# EasyEDA Pro project ProPrj_Practice 4 layer_2025-09-09.epro, schematic Schematic1, sheets 4 to 5 of 5

## Sheets
4 P5: Create Date: 2025-09-04; Page Name: P5; Update Date: 2025-09-03
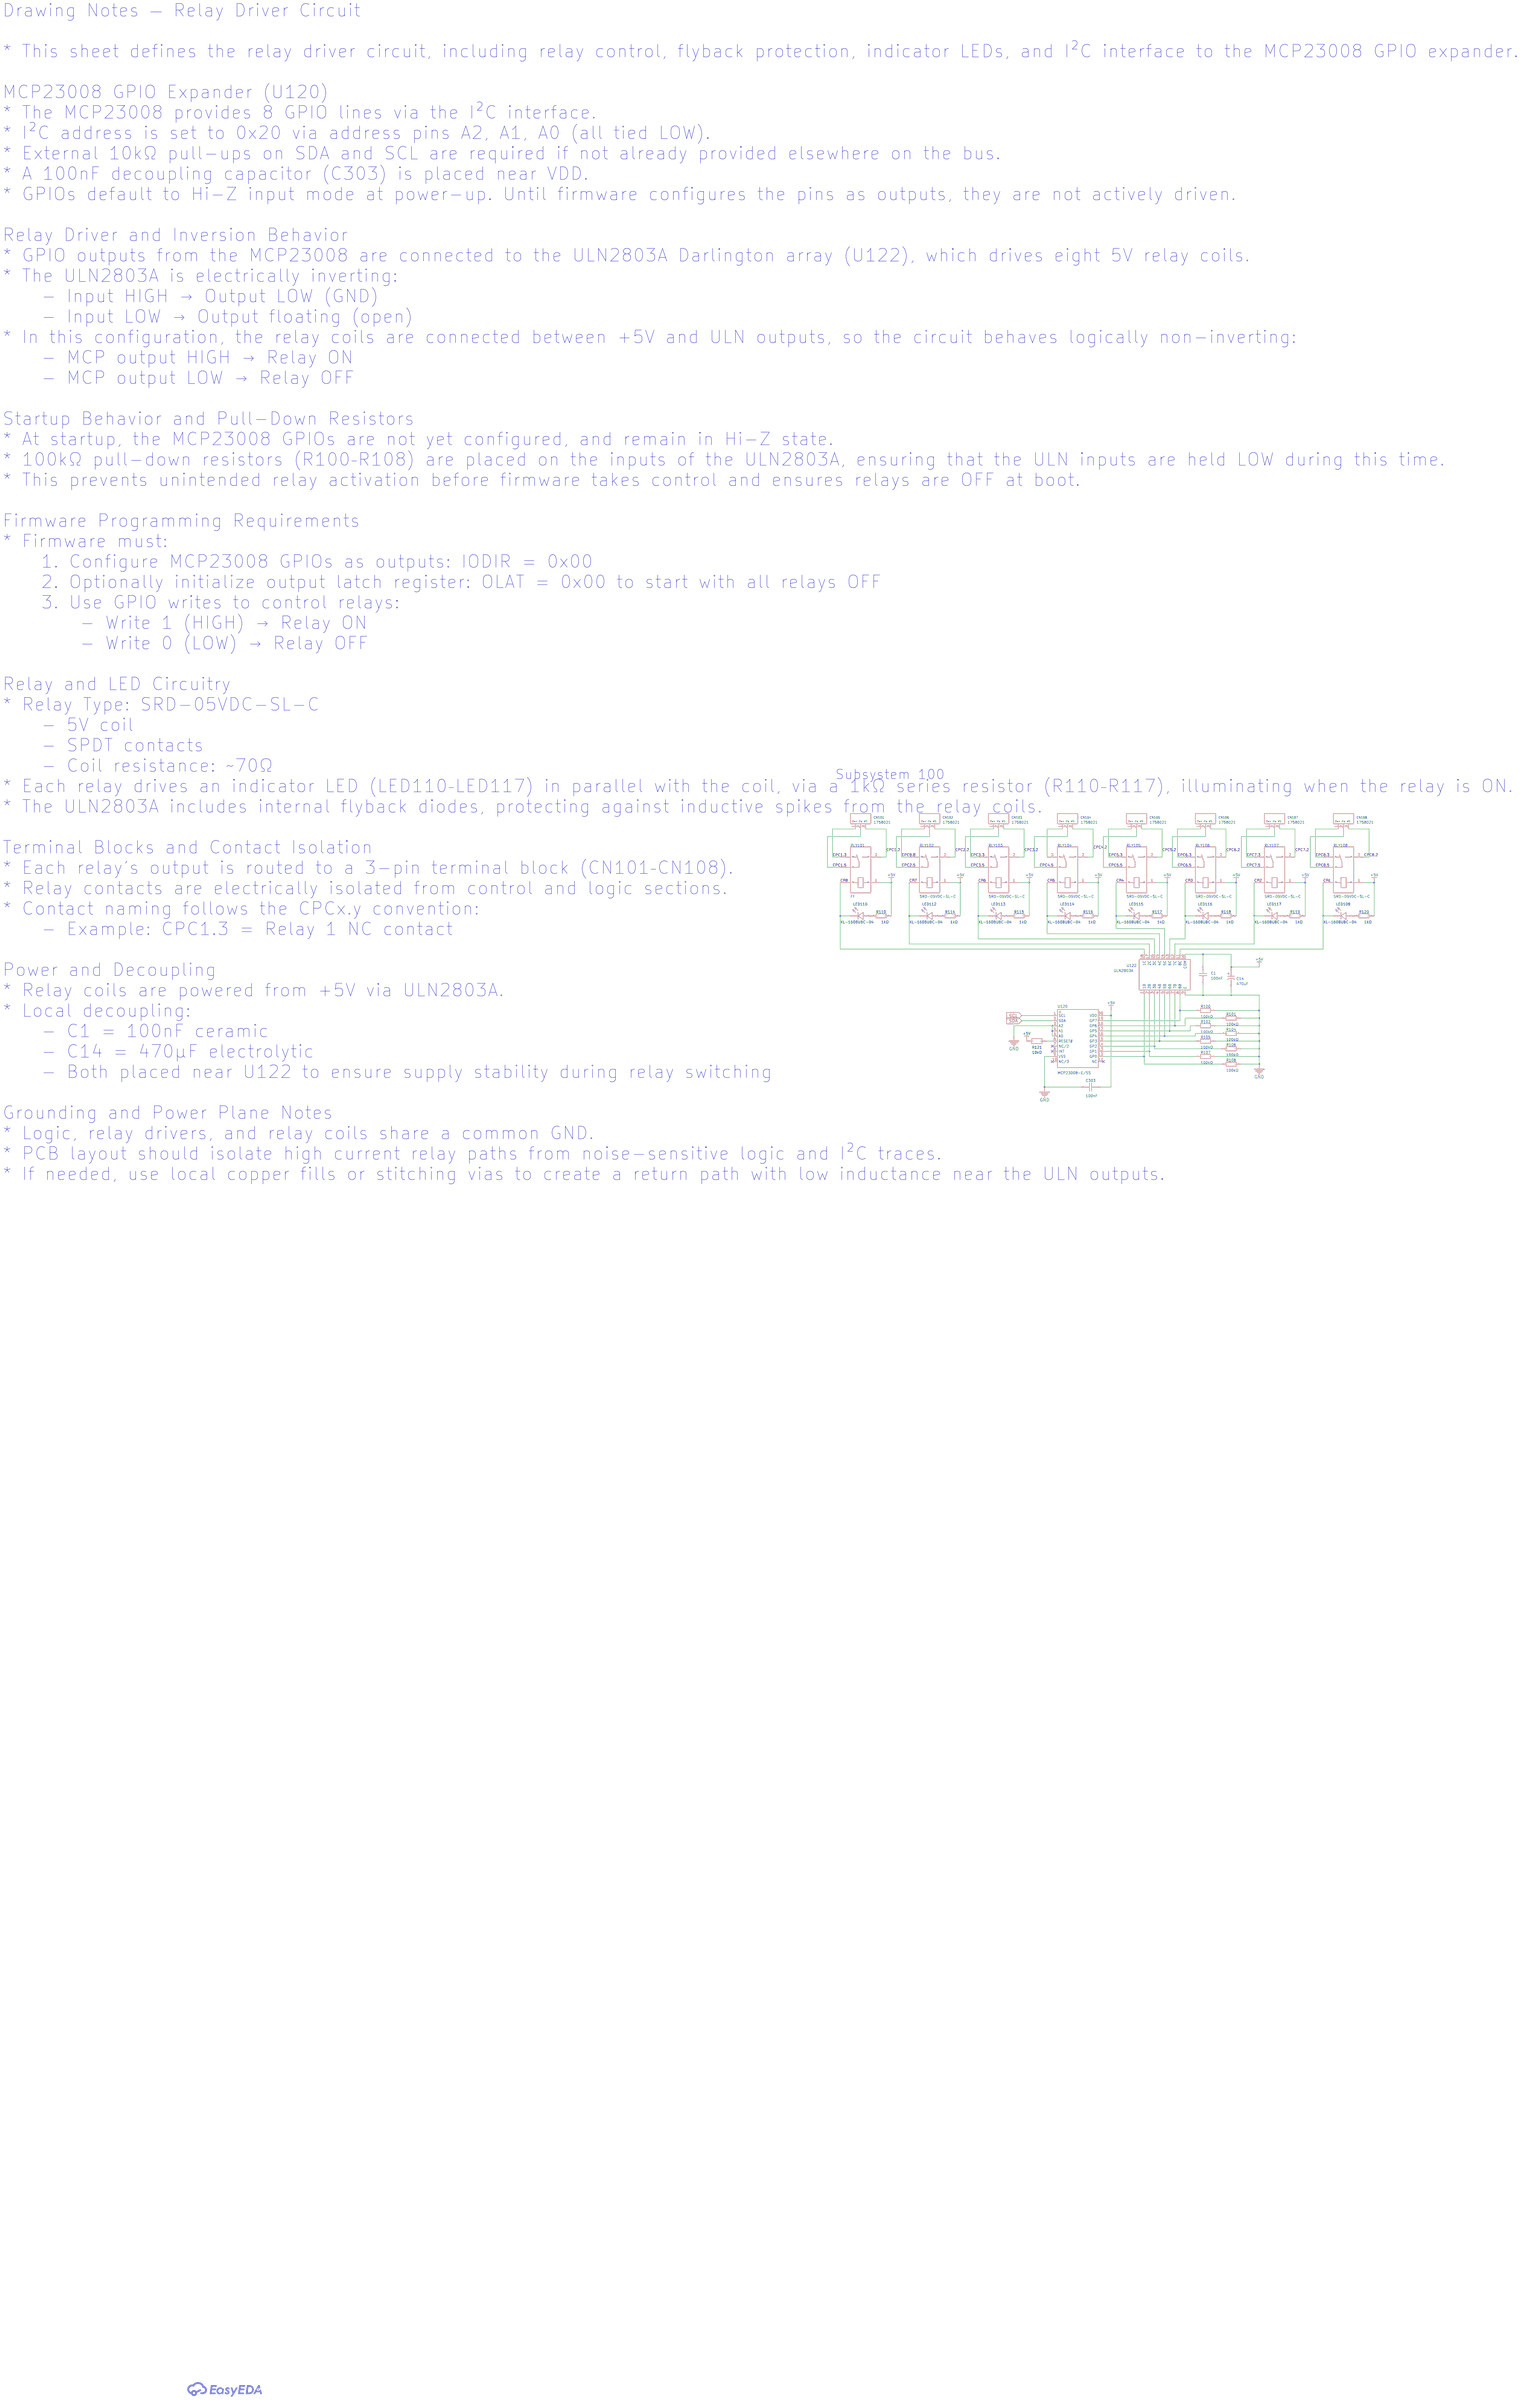
[diagram p13: P5]
5 P6: Create Date: 2025-09-03; Page Name: P6; Update Date: 2025-09-05
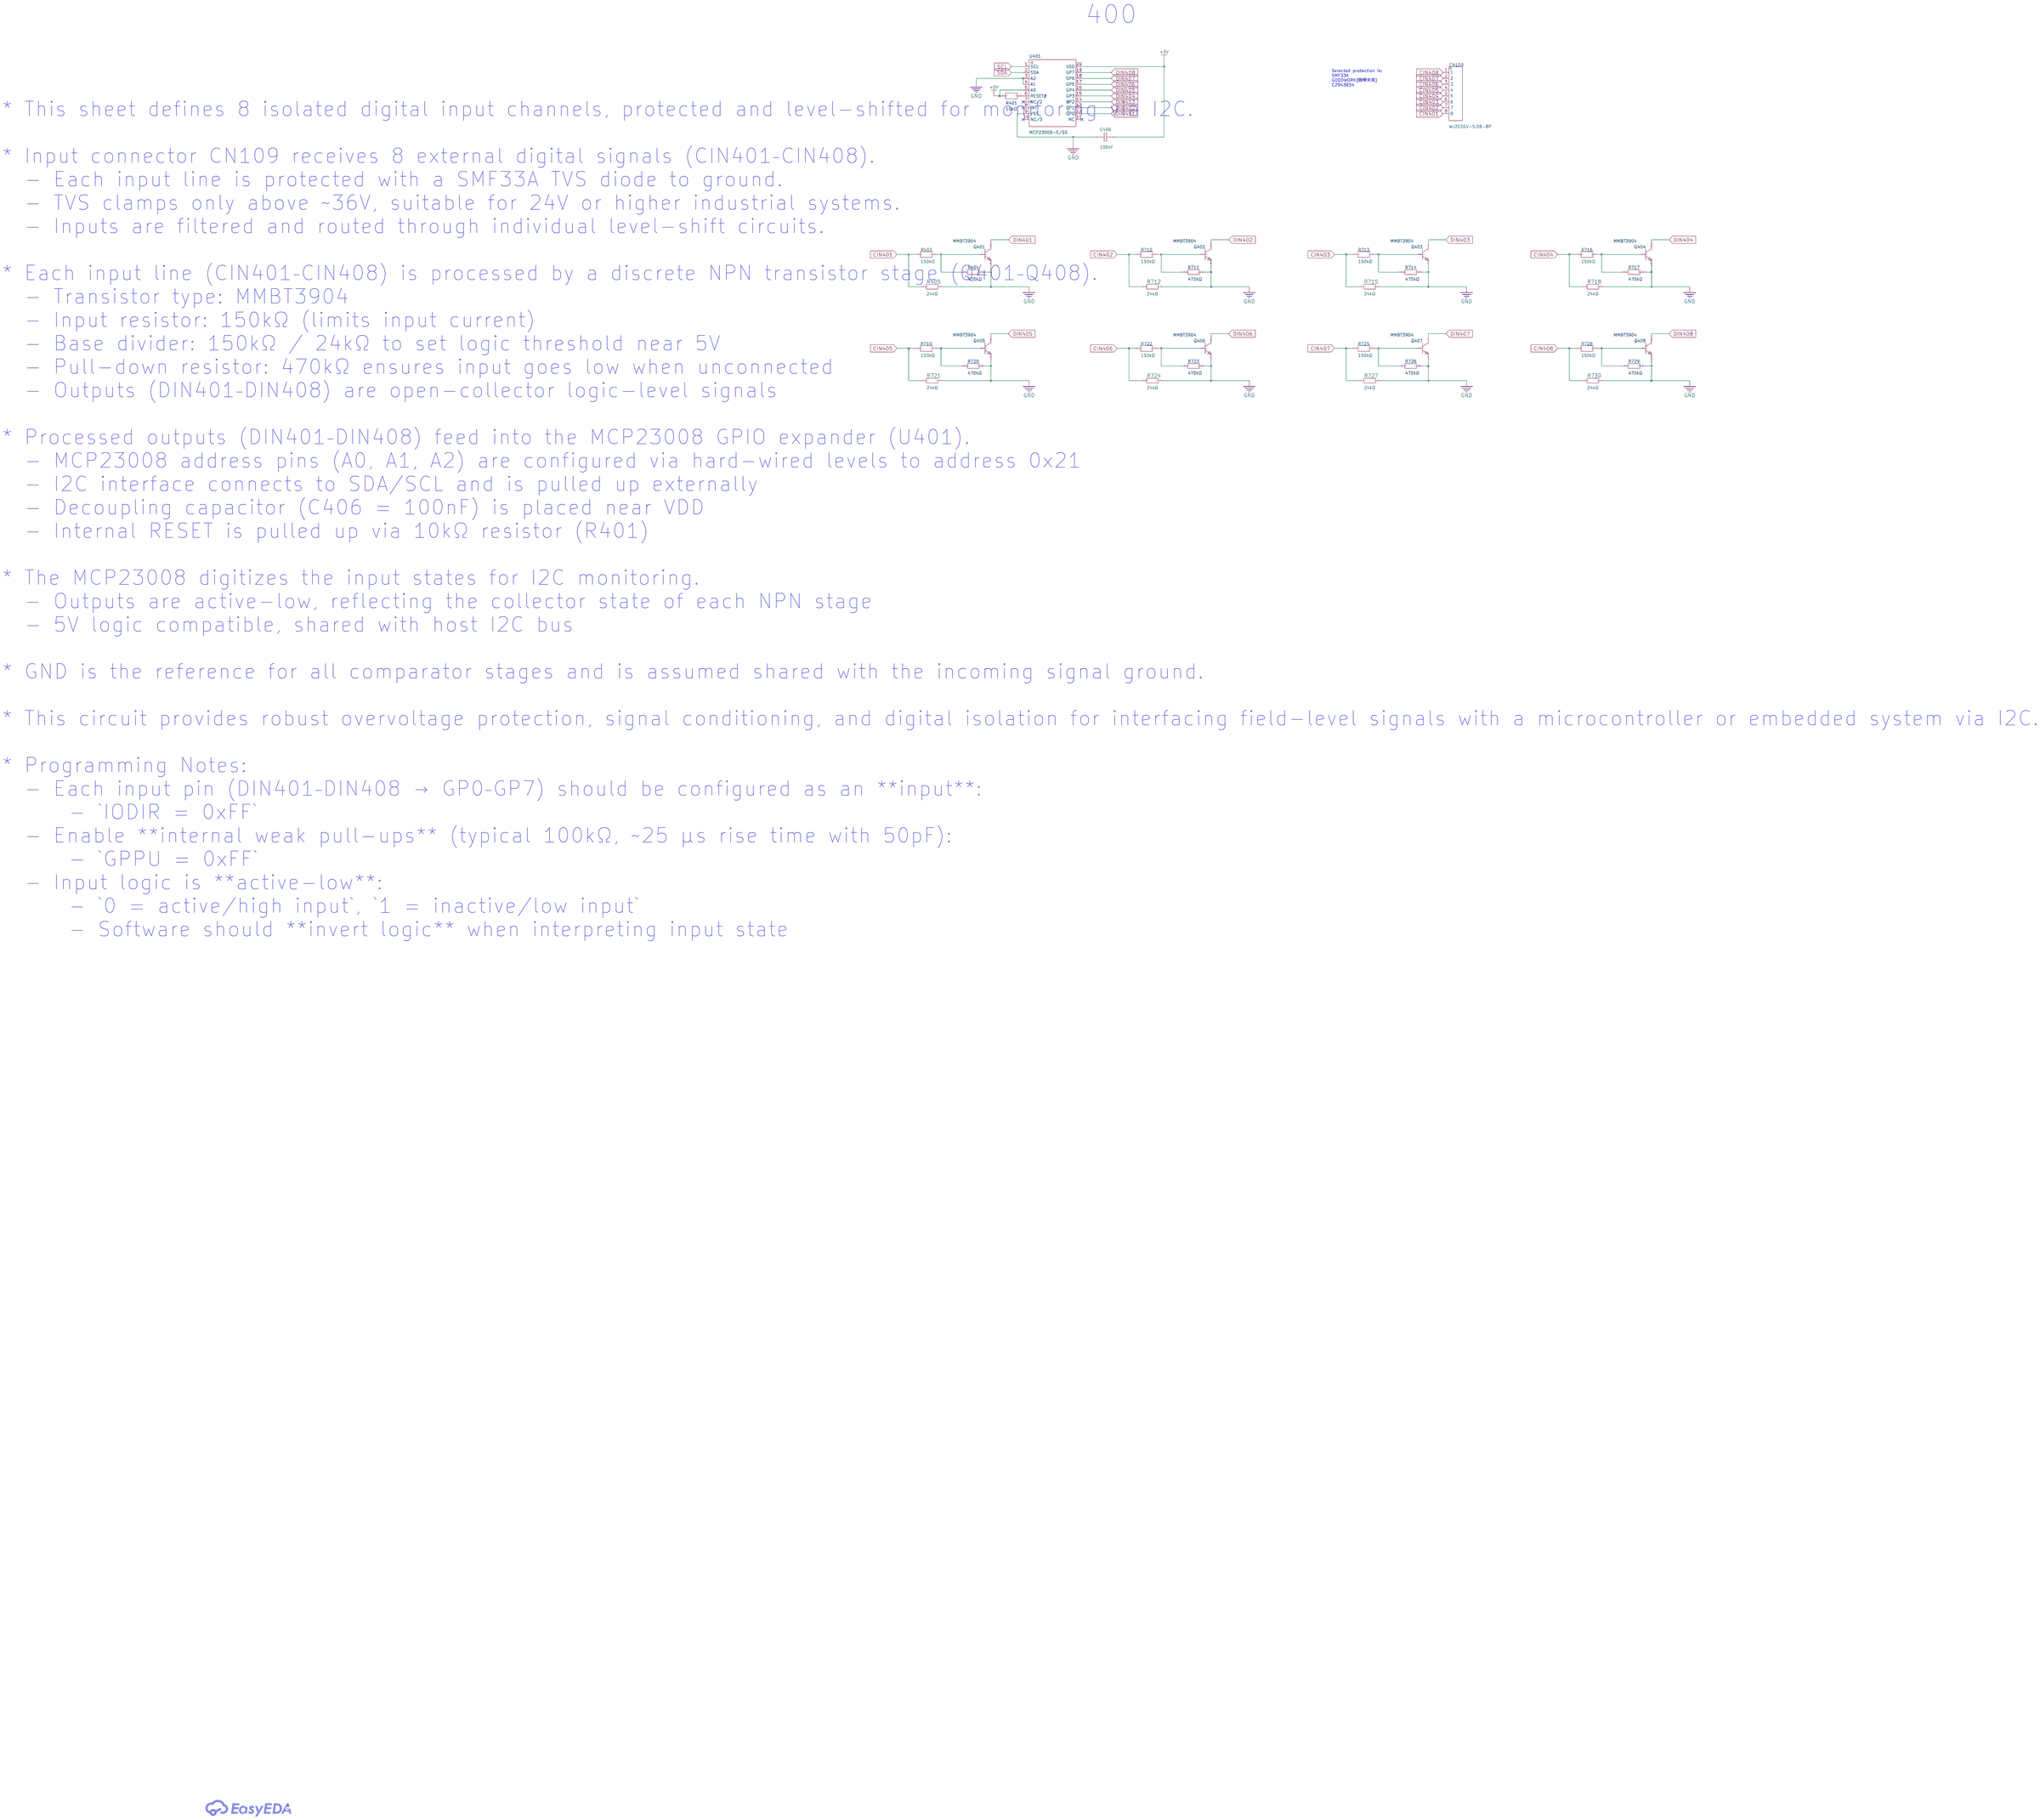
[diagram p14: P6]

## Parts
sheet P5
C1  100nF  [C0603]
C14  470uF  [CAP-SMD_BD6.3-L6.6-W6.6-LS7.6-RD]
C303  100nF  [C0603]
CN101  1758021  [CONN-TH_3P-P5.08_1758021]  (no BOM)
CN102  1758021  [CONN-TH_3P-P5.08_1758021]  (no BOM)
CN103  1758021  [CONN-TH_3P-P5.08_1758021]  (no BOM)
CN104  1758021  [CONN-TH_3P-P5.08_1758021]  (no BOM)
CN105  1758021  [CONN-TH_3P-P5.08_1758021]  (no BOM)
CN106  1758021  [CONN-TH_3P-P5.08_1758021]  (no BOM)
CN107  1758021  [CONN-TH_3P-P5.08_1758021]  (no BOM)
CN108  1758021  [CONN-TH_3P-P5.08_1758021]  (no BOM)
LED108  XL-1608UBC-04  [LED0603-RD_BLUE]
LED110  XL-1608UBC-04  [LED0603-RD_BLUE]
LED112  XL-1608UBC-04  [LED0603-RD_BLUE]
LED113  XL-1608UBC-04  [LED0603-RD_BLUE]
LED114  XL-1608UBC-04  [LED0603-RD_BLUE]
LED115  XL-1608UBC-04  [LED0603-RD_BLUE]
LED116  XL-1608UBC-04  [LED0603-RD_BLUE]
LED117  XL-1608UBC-04  [LED0603-RD_BLUE]
R100  100kΩ  [R0603]
R101  100kΩ  [R0603]
R102  100kΩ  [R0603]
R104  100kΩ  [R0603]
R105  100kΩ  [R0603]
R106  100kΩ  [R0603]
R107  100kΩ  [R0603]
R108  100kΩ  [R0603]
R110  1kΩ  [R0603]
R114  1kΩ  [R0603]
R115  1kΩ  [R0603]
R116  1kΩ  [R0603]
R117  1kΩ  [R0603]
R118  1kΩ  [R0603]
R119  1kΩ  [R0603]
R120  1kΩ  [R0603]
R121  10kΩ  [R0603]
RLY101  FF  [RELAY-TH_SRD-XXVDC-XL-C]  (no BOM)
RLY102  SRD-05VDC-SL-C  [RELAY-TH_SRD-XXVDC-XL-C]  (no BOM)
RLY103  SRD-05VDC-SL-C  [RELAY-TH_SRD-XXVDC-XL-C]  (no BOM)
RLY104  SRD-05VDC-SL-C  [RELAY-TH_SRD-XXVDC-XL-C]  (no BOM)
RLY105  SRD-05VDC-SL-C  [RELAY-TH_SRD-XXVDC-XL-C]  (no BOM)
RLY106  SRD-05VDC-SL-C  [RELAY-TH_SRD-XXVDC-XL-C]  (no BOM)
RLY107  SRD-05VDC-SL-C  [RELAY-TH_SRD-XXVDC-XL-C]  (no BOM)
RLY108  SRD-05VDC-SL-C  [RELAY-TH_SRD-XXVDC-XL-C]  (no BOM)
U120  MCP23008-E/SS  [SSOP-20_L7.2-W5.3-P0.65-LS7.8-BL]
U122  ULN2803A  [SOIC-18_L11.6-W7.5-P1.27-LS10.3-BL]
sheet P6
C406  100nF  [C0603]
CN109  WJ2EDGV-5.08-8P  [CONN-TH_WJ2EDGV-5.08-8P]  (no BOM)
Q401  MMBT3904  [SOT-23-3_L2.9-W1.3-P1.90-LS2.4-BR]
Q402  MMBT3904  [SOT-23-3_L2.9-W1.3-P1.90-LS2.4-BR]
Q403  MMBT3904  [SOT-23-3_L2.9-W1.3-P1.90-LS2.4-BR]
Q404  MMBT3904  [SOT-23-3_L2.9-W1.3-P1.90-LS2.4-BR]
Q405  MMBT3904  [SOT-23-3_L2.9-W1.3-P1.90-LS2.4-BR]
Q406  MMBT3904  [SOT-23-3_L2.9-W1.3-P1.90-LS2.4-BR]
Q407  MMBT3904  [SOT-23-3_L2.9-W1.3-P1.90-LS2.4-BR]
Q408  MMBT3904  [SOT-23-3_L2.9-W1.3-P1.90-LS2.4-BR]
R401  10kΩ  [R0603]
R403  150kΩ  [R0603]
R404  470kΩ  [R0603]
R405  24kΩ  [R0603]
R710  150kΩ  [R0603]
R711  470kΩ  [R0603]
R712  24kΩ  [R0603]
R713  150kΩ  [R0603]
R714  470kΩ  [R0603]
R715  24kΩ  [R0603]
R716  150kΩ  [R0603]
R717  470kΩ  [R0603]
R718  24kΩ  [R0603]
R719  150kΩ  [R0603]
R720  470kΩ  [R0603]
R721  24kΩ  [R0603]
R722  150kΩ  [R0603]
R723  470kΩ  [R0603]
R724  24kΩ  [R0603]
R725  150kΩ  [R0603]
R726  470kΩ  [R0603]
R727  24kΩ  [R0603]
R728  150kΩ  [R0603]
R729  470kΩ  [R0603]
R730  24kΩ  [R0603]
U401  MCP23008-E/SS  [SSOP-20_L7.2-W5.3-P0.65-LS7.8-BL]

## Library data of the parts
C1 C303 C406 = CC0603KRX7R9BB104: Capacitance:100nF Tolerance:±10% Tolerance:±10% Voltage Rating:50V Temperature Coefficient:X7R; LCSC Part Name: 100nF ±10% 50V; Supplier Part: C14663; Manufacturer: YAGEO(国巨); Supplier Footprint: 0603; JLCPCB Part Class: Basic Part; Datasheet: https://atta.szlcsc.com/upload/public/pdf/source/20250214/096C4C206003071F5D32E5F0D8E7F8DF.pdf; Supplier: LCSC; Tolerance: ±10%; Voltage Rating: 50V; Temperature Coefficient: X7R
C14 = RVT1C471M0607: Capacitance: Tolerance:±20% Tolerance:±20% Voltage Rating: Ripple Current:185mA@120Hz Diameter: Height - Seated (Max): Lifetime:2000hrs@105℃ Operating Temperature:-40℃~+105℃ Operating Temperature:-40℃~+105℃; LCSC Part Name: 470uF ±20% 16V; Supplier Part: C2977552; Manufacturer: ROQANG(容强); Supplier Footprint: SMD,D6.3xL7.7mm; JLCPCB Part Class: Extended Part; Datasheet: https://atta.szlcsc.com/upload/public/pdf/source/20220223/DD822675CC1DF2F0C06D5C2255C9C2D9.pdf; Supplier: LCSC; Tolerance: ±20%; Ripple Current: 185mA@120Hz; Lifetime: 2000hrs@105℃; Operating Temperature: -40℃~+105℃
CN101-CN108 = 1758021: Connector Type:Board Side/Socket - Open Number of Positions or Pins:1x3P Pitch:5.08mm Color:Green Mounting Type:Straight Pin Number of Pins:3P Number of Rows:1 Number of PINs Per Row:3 Current Rating:12A Voltage Rating (Max):250V Operating Temperature:- O; LCSC Part Name: 5.08mm 1x3P 排数:1 每排P数:3; Supplier Part: C480557; Manufacturer: Phoenix Contact(菲尼克斯); Supplier Footprint: 插件,P=5.08mm; JLCPCB Part Class: Extended Part; Datasheet: https://item.szlcsc.com/datasheet/1758021/487943.html; Supplier: LCSC; Connector Type: Board Side/Socket - Open; Number of Positions or Pins: 1x3P; Pitch: 5.08mm; Color: Green; Mounting Type: Straight Pin; Number of Pins: 3P; Number of Rows: 1; Number of PINs Per Row: 3; Current Rating: 12A; Voltage Rating (Max): 250V
LED108 LED110 LED112-LED117 = XL-1608UBC-04: Lamp Holder Type:- Illumination Color:Blue Voltage - Forward(Vf):3.3V Voltage - Forward(Vf):3.3V Power(Watts):70mW Forward Current:20mA Wavelength - Dominant:455nm~475nm Wavelength - Dominant:455nm~475nm Peak Wavelength:470nm Diode Configuration:- Lens Co; Supplier Part: C965807; Manufacturer: XINGLIGHT(成兴光); Supplier Footprint: 0603; JLCPCB Part Class: Extended Part; Datasheet: https://item.szlcsc.com/datasheet/XL-1608UBC-04/1051416.html; Supplier: LCSC; Illumination Color: Blue; Voltage - Forward(Vf): 3.3V; Power(Watts): 70mW; Forward Current: 20mA; Wavelength - Dominant: 455nm~475nm; Peak Wavelength: 470nm; Lens Color: Water Clear; Luminous Intensity: 300mcd; Viewing Angle: 120°; Mounting Style: op View Mount
R100-R102 R104-R108 = 0603WAF1003T5E: Type:Thick Film Resistors Resistance:100kΩ Tolerance:±1% Tolerance:±1% Power(Watts): Overload Voltage (Max): Temperature Coefficient:±100ppm/℃ Temperature Coefficient:±100ppm/℃ Operating Temperature Range:-55℃~+155℃ Operating Temperature Range:-55℃~+155℃; LCSC Part Name: 100kΩ ±1% 100mW 厚膜电阻; Supplier Part: C25803; Manufacturer: UNI-ROYAL(厚声); Supplier Footprint: 0603; JLCPCB Part Class: Basic Part; Datasheet: https://atta.szlcsc.com/upload/public/pdf/source/20200306/C422600_1E6D84923E4A46A82E41ADD87F860B5C.pdf; Supplier: LCSC; Type: Thick Film Resistors; Tolerance: ±1%; Temperature Coefficient: ±100ppm/℃; Operating Temperature Range: -55℃~+155℃
R110 R114-R120 = 0603WAF1001T5E: Type:Thick Film Resistors Resistance:1kΩ Tolerance:±1% Tolerance:±1% Power(Watts): Overload Voltage (Max): Temperature Coefficient:±100ppm/℃ Temperature Coefficient:±100ppm/℃ Operating Temperature Range:-55℃~+155℃ Operating Temperature Range:-55℃~+155℃; LCSC Part Name: 1kΩ ±1% 100mW 厚膜电阻; Supplier Part: C21190; Manufacturer: UNI-ROYAL(厚声); Supplier Footprint: 0603; JLCPCB Part Class: Basic Part; Datasheet: https://atta.szlcsc.com/upload/public/pdf/source/20200306/C422600_1E6D84923E4A46A82E41ADD87F860B5C.pdf; Supplier: LCSC; Type: Thick Film Resistors; Tolerance: ±1%; Temperature Coefficient: ±100ppm/℃; Operating Temperature Range: -55℃~+155℃
R121 R401 = FRC0603J103 TS: Type:Thick Film Resistors Resistance:10kΩ Tolerance:±5% Tolerance:±5% Power(Watts):0.1W Voltage-Supply(Max):75V Temperature Coefficient:±100ppm/℃ Temperature Coefficient:±100ppm/℃ Operating Temperature:-55℃~+155℃ Operating Temperature:-55℃~+155℃; LCSC Part Name: 10kΩ ±5% 100mW 厚膜电阻; Supplier Part: C2930027; Manufacturer: FOJAN(富捷); Supplier Footprint: 0603; JLCPCB Part Class: Extended Part; Datasheet: https://atta.szlcsc.com/upload/public/pdf/source/20211221/925EC7D7225764EE0046F22065062C87.pdf; Supplier: LCSC; Type: Thick Film Resistors; Tolerance: ±5%; Power(Watts): 0.1W; Voltage-Supply(Max): 75V; Temperature Coefficient: ±100ppm/℃; Operating Temperature: -55℃~+155℃
RLY101-RLY108 = SRD-05VDC-SL-C: Coil Voltage:5V Contact Form:1 Form C: 1C (SPDT-CO) Number of Pins:5 Contact Rating:- Switching Voltage(Max):250V@AC Coil Rated Power:360mW Switching Current(Max):15A Coil Type:Non-Polarized - Single Coil Coil Resistance:70Ω Contact Resistance:100mΩ Opera; LCSC Part Name: 蓝色 单组转换型继电器; Supplier Part: C35449; Manufacturer: 松乐; Supplier Footprint: 插件,15.6x19.2mm; JLCPCB Part Class: Extended Part; Datasheet: https://item.szlcsc.com/datasheet/SRD-05VDC-SL-C/36422.html; Supplier: LCSC; Coil Voltage: 5V; Contact Form: 1 Form C: 1C (SPDT-CO); Number of Pins: 5; Switching Voltage(Max): 250V@AC; Coil Rated Power: 360mW; Switching Current(Max): 15A; Coil Type: Non-Polarized - Single Coil; Coil Resistance: 70Ω; Contact Resistance: 100mΩ; Operate Time: 10ms; Release Time: 10ms
U120 U401 = MCP23008-E/SS: Interface:I2C Number of I/O:8 Interrupt Output:With Interrupt Output Output Type: Supply Voltage:- Supply Voltage:- Output Source current:- Output Sink Current:- Clock Frequency:1.7MHz Operating Temperature:- Operating Temperature:-; LCSC Part Name: 8位I/O扩展器带串行接口; Supplier Part: C148011; Manufacturer: MICROCHIP(美国微芯); Supplier Footprint: SSOP-20-208mil; JLCPCB Part Class: Extended Part; Datasheet: https://atta.szlcsc.com/upload/public/pdf/source/20171228/C152205_15144475388971215001.pdf; Supplier: LCSC; Interface: I2C; Number of I/O: 8; Interrupt Output: With Interrupt Output; Clock Frequency: 1.7MHz
U122 = ULN2803A_C181731: number of channels:Eight channels Maximum collector Emitter Voltage (Vceo):50V Collector Current(Ic):500mA maximum input voltage:30V Operating Temperature:-40℃~+85℃ Operating Temperature:-40℃~+85℃; Supplier Part: C181731; Manufacturer: Mixic(中科芯亿达); Supplier Footprint: SOIC-18-300mil; JLCPCB Part Class: Extended Part; Datasheet: https://atta.szlcsc.com/upload/public/pdf/source/20180207/C181731_15179898068571356493.pdf; Supplier: LCSC; number of channels: Eight channels; Maximum collector Emitter Voltage (Vceo): 50V; Collector Current(Ic): 500mA; maximum input voltage: 30V; Operating Temperature: -40℃~+85℃
CN109 = WJ2EDGV-5.08-8P: Connector Type:Board Side/Socket - Open Termination Style:- Number of Positions or Pins:1x8P Pitch:5.08mm Color:Green Mounting Type:Straight Pin Number of Pins:8P Number of Rows:1 Number of PINs Per Row:8 Current Rating:20A Voltage Rating (Max):450V Wire; LCSC Part Name: 1x8P 5.08mm 排数:1 每排P数:8; Supplier Part: C23595; Manufacturer: KANGNEX(康奈克斯电气); Supplier Footprint: 插件,P=5.08mm; JLCPCB Part Class: Extended Part; Datasheet: https://item.szlcsc.com/datasheet/WJ2EDGV-5.08-8P/24331.html; Supplier: LCSC; Connector Type: Board Side/Socket - Open; Number of Positions or Pins: 1x8P; Pitch: 5.08mm; Color: Green; Mounting Type: Straight Pin; Number of Pins: 8P; Number of Rows: 1; Number of PINs Per Row: 8; Current Rating: 20A; Voltage Rating (Max): 450V; Operating Temperature: -40℃~+105℃
Q401-Q408 = MMBT3904_C22374713: Supplier Part: C22374713; Manufacturer: DOWO(东沃); Supplier Footprint: SOT-23; JLCPCB Part Class: Extended Part; Datasheet: https://atta.szlcsc.com/upload/public/pdf/source/20240402/5DDCD9F172A0F6C20D9FAF0C25C6F6AF.pdf; Supplier: LCSC
R403 R710 R713 R716 R719 R722 R725 R728 = FRC0603F1503TS: Type:Thick Film Resistors Resistance:150kΩ Tolerance:±1% Tolerance:±1% Power(Watts): Overload Voltage (Max): Temperature Coefficient:±100ppm/℃ Temperature Coefficient:±100ppm/℃ Operating Temperature Range:-55℃~+155℃ Operating Temperature Range:-55℃~+155℃; LCSC Part Name: 150kΩ ±1% 100mW 厚膜电阻; Supplier Part: C2906993; Manufacturer: FOJAN(富捷); Supplier Footprint: 0603; JLCPCB Part Class: Extended Part; Datasheet: https://atta.szlcsc.com/upload/public/pdf/source/20211221/925EC7D7225764EE0046F22065062C87.pdf; Supplier: LCSC; Type: Thick Film Resistors; Tolerance: ±1%; Temperature Coefficient: ±100ppm/℃; Operating Temperature Range: -55℃~+155℃
R404 R711 R714 R717 R720 R723 R726 R729 = RC0603FR-07470KL: Type:Thick Film Resistor Resistance:470kΩ Tolerance:±1% Tolerance:±1% Power(Watts):100mW Voltage-Supply(Max):75V Temperature Coefficient:±100ppm/℃ Temperature Coefficient:±100ppm/℃ Operating Temperature:-55℃~+155℃ Operating Temperature:-55℃~+155℃; LCSC Part Name: 厚膜电阻 470kΩ ±1% 100mW; Supplier Part: C114622; Manufacturer: YAGEO(国巨); Supplier Footprint: 0603; JLCPCB Part Class: Extended Part; Datasheet: https://atta.szlcsc.com/upload/public/pdf/source/20250610/89E4D743C004A82A45145C7A2CC3A578.pdf; Supplier: LCSC; Type: Thick Film Resistor; Tolerance: ±1%; Power(Watts): 100mW; Voltage-Supply(Max): 75V; Temperature Coefficient: ±100ppm/℃; Operating Temperature: -55℃~+155℃
R405 R712 R715 R718 R721 R724 R727 R730 = 0603WAF2402T5E: Type:Thick Film Resistors Resistance:24kΩ Tolerance:±1% Tolerance:±1% Power(Watts): Overload Voltage (Max): Temperature Coefficient:±100ppm/℃ Temperature Coefficient:±100ppm/℃ Operating Temperature Range:-55℃~+155℃ Operating Temperature Range:-55℃~+155℃; LCSC Part Name: 24kΩ ±1% 100mW 厚膜电阻; Supplier Part: C23352; Manufacturer: UNI-ROYAL(厚声); Supplier Footprint: 0603; JLCPCB Part Class: Basic Part; Datasheet: https://atta.szlcsc.com/upload/public/pdf/source/20200306/C422600_1E6D84923E4A46A82E41ADD87F860B5C.pdf; Supplier: LCSC; Type: Thick Film Resistors; Tolerance: ±1%; Temperature Coefficient: ±100ppm/℃; Operating Temperature Range: -55℃~+155℃

## Nets
+5V: C1.2 C14.1 C303.2 C406.2 R110.1 R114.1 R115.1 R116.1 R117.1 R118.1 R119.1 R120.1 R121.1 R401.1 RLY101.1 RLY102.1 RLY103.1 RLY104.1 RLY105.1 RLY106.1 RLY107.1 RLY108.1 U120.20(VDD) U122.10(COM) U401.5(A0) U401.20(VDD) ; also on sheet 1 2 3
GND: C1.1 C14.2 C303.1 C406.1 Q401.2(E) Q402.2(E) Q403.2(E) Q404.2(E) Q405.2(E) Q406.2(E) Q407.2(E) Q408.2(E) R100.2 R101.2 R102.2 R104.2 R105.2 R106.2 R107.2 R108.2 R404.2 R405.2 R711.2 R712.2 R714.2 R715.2 R717.2 R718.2 R720.2 R721.2 R723.2 R724.2 R726.2 R727.2 R729.2 R730.2 U120.3(A2) U120.4(A1) U120.5(A0) U120.9(VSS) U122.9(E) U401.3(A2) U401.4(A1) U401.9(VSS) ; also on sheet 1 2 3
CIN401: CN109.8 R403.1 R405.1
CIN402: CN109.7 R710.1 R712.1
CIN403: CN109.6 R713.1 R715.1
CIN404: CN109.5 R716.1 R718.1
CIN405: CN109.4 R719.1 R721.1
CIN406: CN109.3 R722.1 R724.1
CIN407: CN109.2 R725.1 R727.1
CIN408: CN109.1 R728.1 R730.1
CP1: LED108.1(K) RLY108.4 U122.11(8C)
CP2: LED117.1(K) RLY107.4 U122.12(7C)
CP3: LED116.1(K) RLY106.4 U122.13(6C)
CP4: LED115.1(K) RLY105.4 U122.14(5C)
CP5: LED114.1(K) RLY104.4 U122.15(4C)
CP6: LED113.1(K) RLY103.4 U122.16(3C)
CP7: LED112.1(K) RLY102.4 U122.17(2C)
CP8: LED110.1(K) RLY101.4 U122.18(1C)
CPC1.2: CN101.3 RLY101.2
CPC1.3: CN101.1 RLY101.3
CPC1.5: CN101.2 RLY101.5
CPC2.2: CN102.3 RLY102.2
CPC2.5: CN102.2 RLY102.5
CPC3.2: CN103.3 RLY103.2
CPC3.3: CN103.1 RLY103.3
CPC3.5: CN103.2 RLY103.5
CPC4.2: CN104.3 RLY104.2
CPC4.5: CN104.2 RLY104.5
CPC5.2: CN105.3 RLY105.2
CPC5.3: CN105.1 RLY105.3
CPC5.5: CN105.2 RLY105.5
CPC6.2: CN106.3 RLY106.2
CPC6.3: CN106.1 RLY106.3
CPC6.5: CN106.2 RLY106.5
CPC7.2: CN107.3 RLY107.2
CPC7.3: CN107.1 RLY107.3
CPC7.5: CN107.2 RLY107.5
CPC8.2: CN108.3 RLY108.2
CPC8.3: CN108.1 RLY108.3
CPC8.5: CN108.2 RLY108.5
CPC8.8: CN102.1 RLY102.3
DIN401: Q401.3(C) U401.12(GP0)
DIN402: Q402.3(C) U401.13(GP1)
DIN403: Q403.3(C) U401.14(GP2)
DIN404: Q404.3(C) U401.15(GP3)
DIN405: Q405.3(C) U401.16(GP4)
DIN406: Q406.3(C) U401.17(GP5)
DIN407: Q407.3(C) U401.18(GP6)
DIN408: Q408.3(C) U401.19(GP7)
SCL: U120.1(SCL) U401.1(SCL) ; also on sheet 1 2 3
SDA: U120.2(SDA) U401.2(SDA) ; also on sheet 1 2 3
$5N2312: LED110.2(A) R110.2
$5N2313: LED113.2(A) R115.2
$5N2314: LED112.2(A) R114.2
$5N2315: LED114.2(A) R116.2
$5N2316: LED115.2(A) R117.2
$5N2317: LED116.2(A) R118.2
$5N2318: LED117.2(A) R119.2
$5N2319: LED108.2(A) R120.2
$5N2320: R108.1 U120.12(GP0) U122.1(1B)
$5N2321: R107.1 U120.13(GP1) U122.2(2B)
$5N2322: R106.1 U120.14(GP2) U122.3(3B)
$5N2323: R105.1 U120.15(GP3) U122.4(4B)
$5N2324: R102.1 U120.17(GP5) U122.6(6B)
$5N2325: R101.1 U120.18(GP6) U122.7(7B)
$5N2326: R100.1 U120.19(GP7) U122.8(8B)
$5N2327: R104.1 U120.16(GP4) U122.5(5B)
$5N2332: R121.2 U120.6(RESET#)
$5N2391: CN104.1 RLY104.3
$6N3207: Q401.1(B) R403.2 R404.1
$6N3208: R401.2 U401.6(RESET#)
$6N3540: Q402.1(B) R710.2 R711.1
$6N3722: Q403.1(B) R713.2 R714.1
$6N3904: Q404.1(B) R716.2 R717.1
$6N4086: Q405.1(B) R719.2 R720.1
$6N4268: Q406.1(B) R722.2 R723.1
$6N4450: Q407.1(B) R725.2 R726.1
$6N4632: Q408.1(B) R728.2 R729.1

Not connected (* = marked no-connect by the designer): U120 7(NC/2)* 8(INT)* 10(NC/3)* 11(NC)*; U401 7(NC/2)* 8(INT)* 10(NC/3)* 11(NC)*

## Notes on the sheets
sheet 4
- Subsystem 100
- Drawing Notes — Relay Driver Circuit
  * This sheet defines the relay driver circuit, including relay control, flyback protection, indicator LEDs, and I²C interface to the MCP23008 GPIO expander.
  MCP23008 GPIO Expander (U120)
  * The MCP23008 provides 8 GPIO lines via the I²C interface.
  * I²C address is set to 0x20 via address pins A2, A1, A0 (all tied LOW).
  * External 10kΩ pull-ups on SDA and SCL are required if not already provided elsewhere on the bus.
  * A 100nF decoupling capacitor (C303) is placed near VDD.
  * GPIOs default to Hi-Z input mode at power-up. Until firmware configures the pins as outputs, they are not actively driven.
  Relay Driver and Inversion Behavior
  * GPIO outputs from the MCP23008 are connected to the ULN2803A Darlington array (U122), which drives eight 5V relay coils.
  * The ULN2803A is electrically inverting:
      - Input HIGH → Output LOW (GND)
      - Input LOW → Output floating (open)
  * In this configuration, the relay coils are connected between +5V and ULN outputs, so the circuit behaves logically non-inverting:
      - MCP output HIGH → Relay ON
      - MCP output LOW → Relay OFF
  Startup Behavior and Pull-Down Resistors
  * At startup, the MCP23008 GPIOs are not yet configured, and remain in Hi-Z state.
  * 100kΩ pull-down resistors (R100–R108) are placed on the inputs of the ULN2803A, ensuring that the ULN inputs are held LOW during this time.
  * This prevents unintended relay activation before firmware takes control and ensures relays are OFF at boot.
  Firmware Programming Requirements
  * Firmware must:
      1. Configure MCP23008 GPIOs as outputs: IODIR = 0x00
      2. Optionally initialize output latch register: OLAT = 0x00 to start with all relays OFF
      3. Use GPIO writes to control relays:
          - Write 1 (HIGH) → Relay ON
          - Write 0 (LOW) → Relay OFF
  Relay and LED Circuitry
  * Relay Type: SRD-05VDC-SL-C
      - 5V coil
      - SPDT contacts
      - Coil resistance: ~70Ω
  * Each relay drives an indicator LED (LED110–LED117) in parallel with the coil, via a 1kΩ series resistor (R110–R117), illuminating when the relay is ON.
  * The ULN2803A includes internal flyback diodes, protecting against inductive spikes from the relay coils.
  Terminal Blocks and Contact Isolation
  * Each relay’s output is routed to a 3-pin terminal block (CN101–CN108).
  * Relay contacts are electrically isolated from control and logic sections.
  * Contact naming follows the CPCx.y convention:
      - Example: CPC1.3 = Relay 1 NC contact
  Power and Decoupling
  * Relay coils are powered from +5V via ULN2803A.
  * Local decoupling:
      - C1 = 100nF ceramic
      - C14 = 470µF electrolytic
      - Both placed near U122 to ensure supply stability during relay switching
  Grounding and Power Plane Notes
  * Logic, relay drivers, and relay coils share a common GND.
  * PCB layout should isolate high current relay paths from noise-sensitive logic and I²C traces.
  * If needed, use local copper fills or stitching vias to create a return path with low inductance near the ULN outputs.
sheet 5
- 400
- Selected protection is:
  SMF33A
  GOODWORK(固得沃克)
  C2943834
- * This sheet defines 8 isolated digital input channels, protected and level-shifted for monitoring via I2C.
  * Input connector CN109 receives 8 external digital signals (CIN401–CIN408).
    - Each input line is protected with a SMF33A TVS diode to ground.
    - TVS clamps only above ~36V, suitable for 24V or higher industrial systems.
    - Inputs are filtered and routed through individual level-shift circuits.
  * Each input line (CIN401–CIN408) is processed by a discrete NPN transistor stage (Q401–Q408).
    - Transistor type: MMBT3904
    - Input resistor: 150kΩ (limits input current)
    - Base divider: 150kΩ / 24kΩ to set logic threshold near 5V
    - Pull-down resistor: 470kΩ ensures input goes low when unconnected
    - Outputs (DIN401–DIN408) are open-collector logic-level signals
  * Processed outputs (DIN401–DIN408) feed into the MCP23008 GPIO expander (U401).
    - MCP23008 address pins (A0, A1, A2) are configured via hard-wired levels to address 0x21
    - I2C interface connects to SDA/SCL and is pulled up externally
    - Decoupling capacitor (C406 = 100nF) is placed near VDD
    - Internal RESET is pulled up via 10kΩ resistor (R401)
  * The MCP23008 digitizes the input states for I2C monitoring.
    - Outputs are active-low, reflecting the collector state of each NPN stage
    - 5V logic compatible, shared with host I2C bus
  * GND is the reference for all comparator stages and is assumed shared with the incoming signal ground.
  * This circuit provides robust overvoltage protection, signal conditioning, and digital isolation for interfacing field-level signals with a microcontroller or embedded system via I2C.
  * Programming Notes:
    - Each input pin (DIN401–DIN408 → GP0–GP7) should be configured as an **input**:
        - `IODIR = 0xFF`
    - Enable **internal weak pull-ups** (typical 100kΩ, ~25 µs rise time with 50pF):
        - `GPPU = 0xFF`
    - Input logic is **active-low**:
        - `0 = active/high input`, `1 = inactive/low input`
        - Software should **invert logic** when interpreting input state
